# EAGLE board receiver_2v0 (EAGLE 6.2)
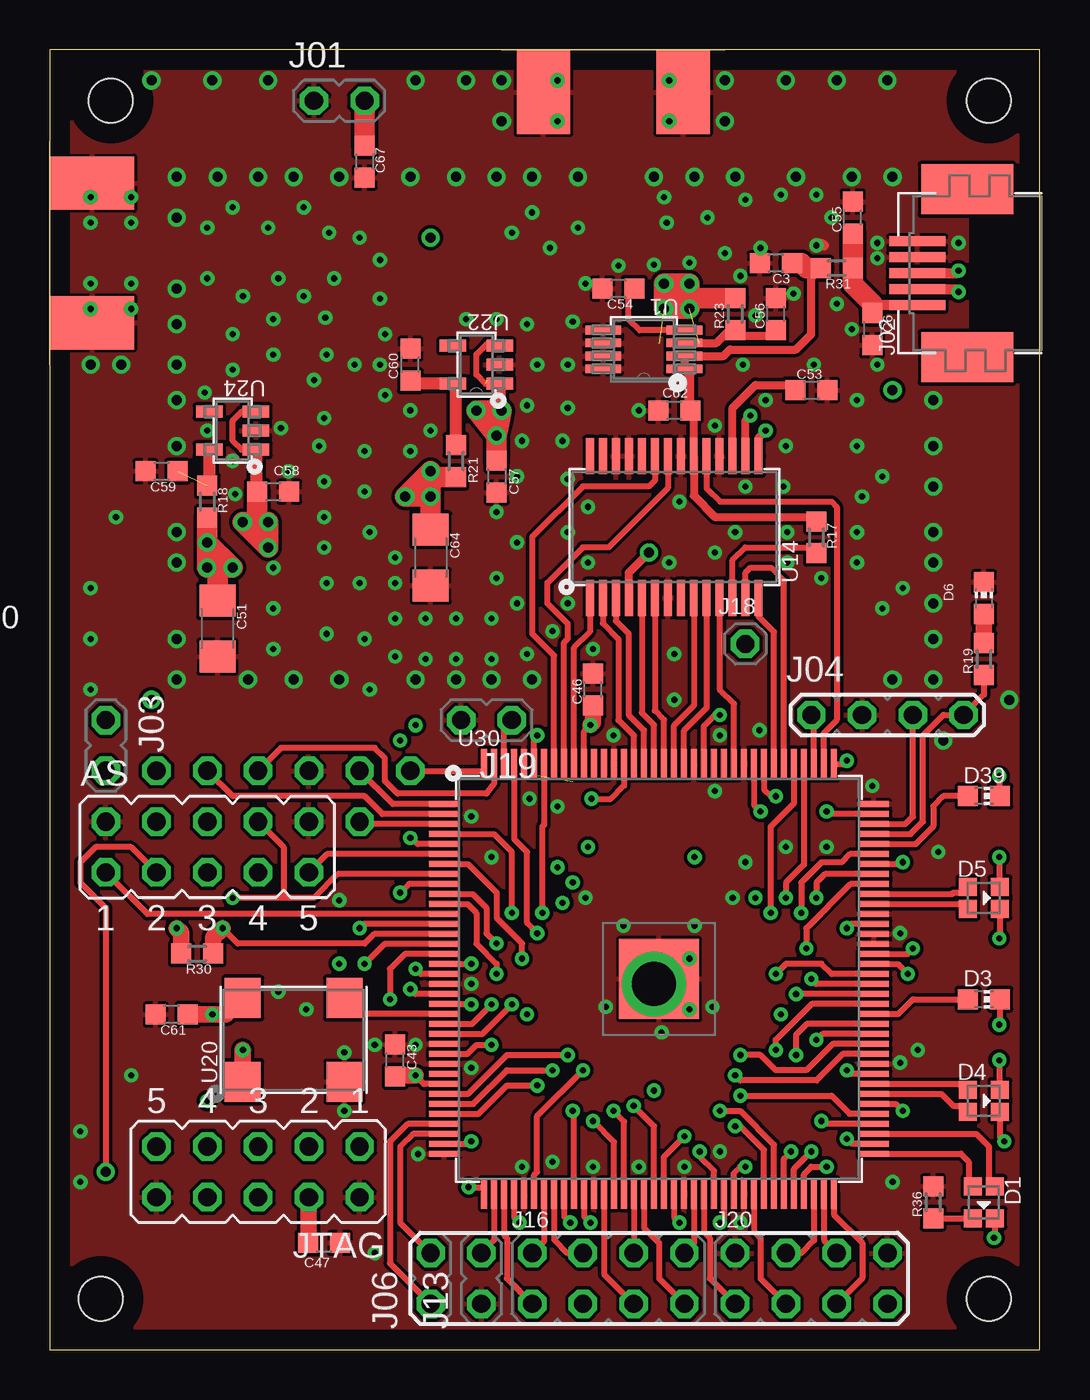
[diagram p3: board, top side]
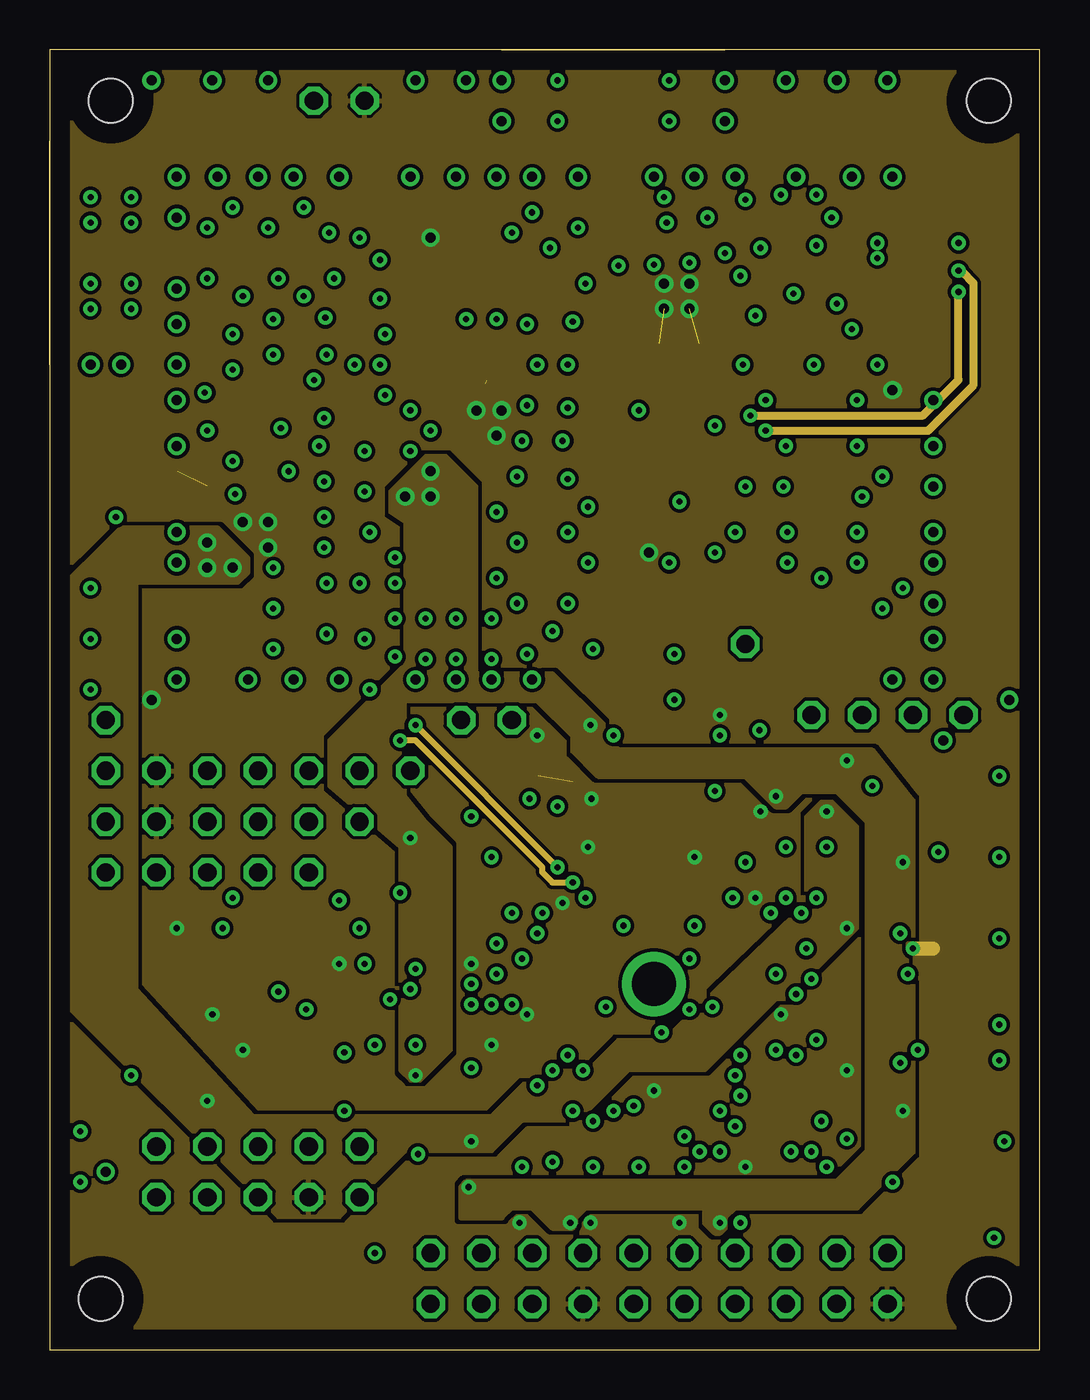
[diagram p4: board, inner layer Route8]
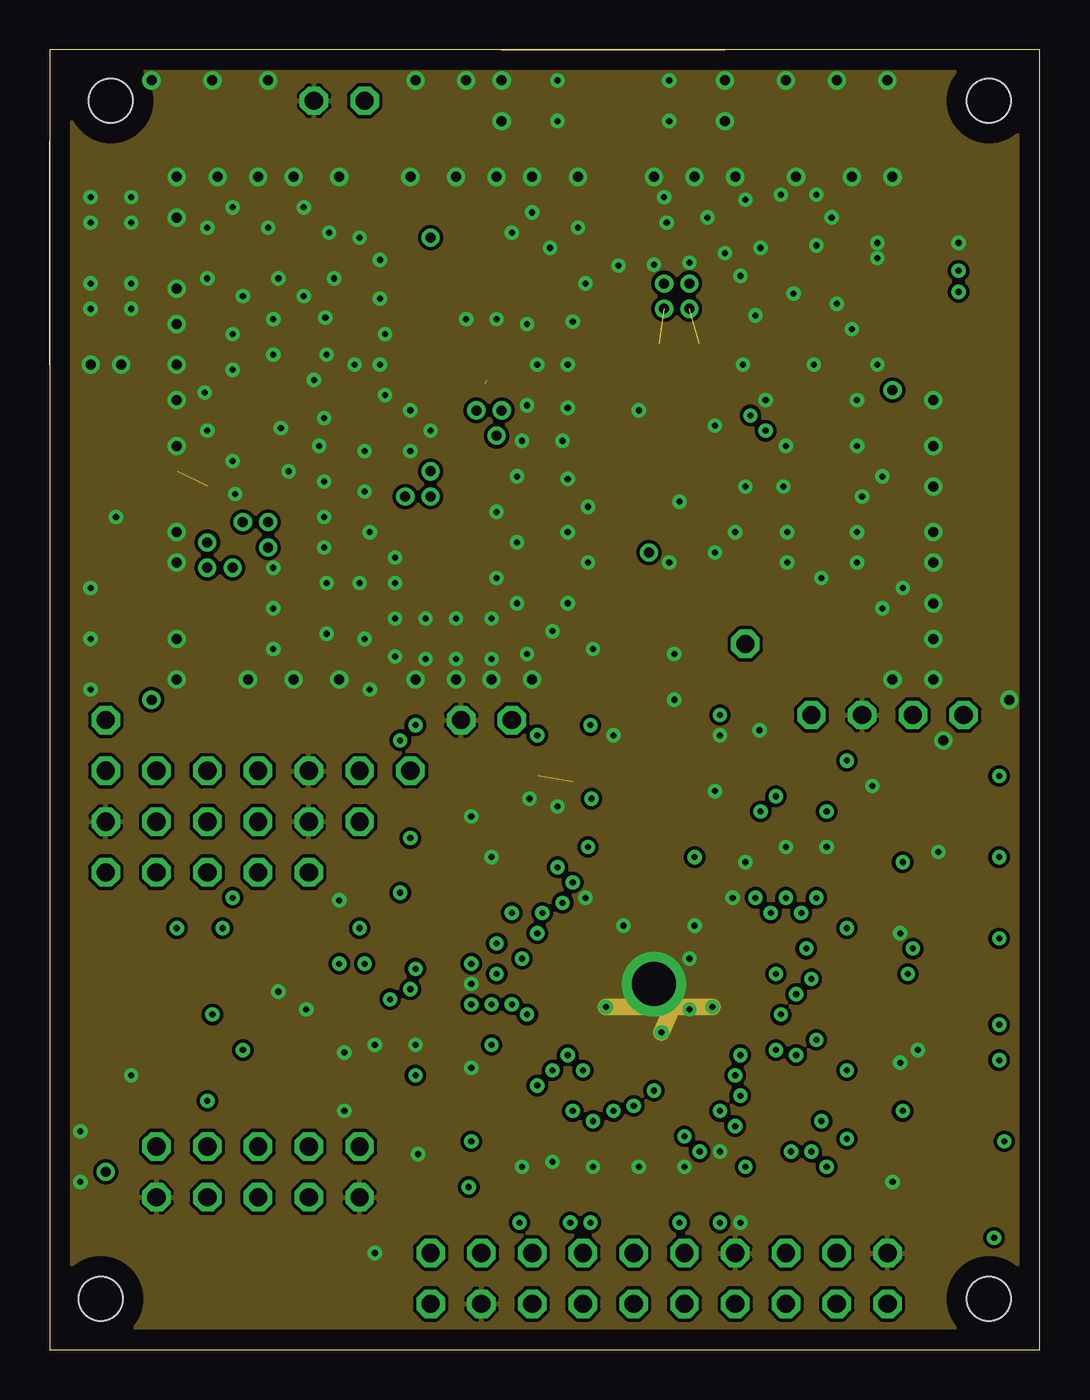
[diagram p5: board, inner layer GND]
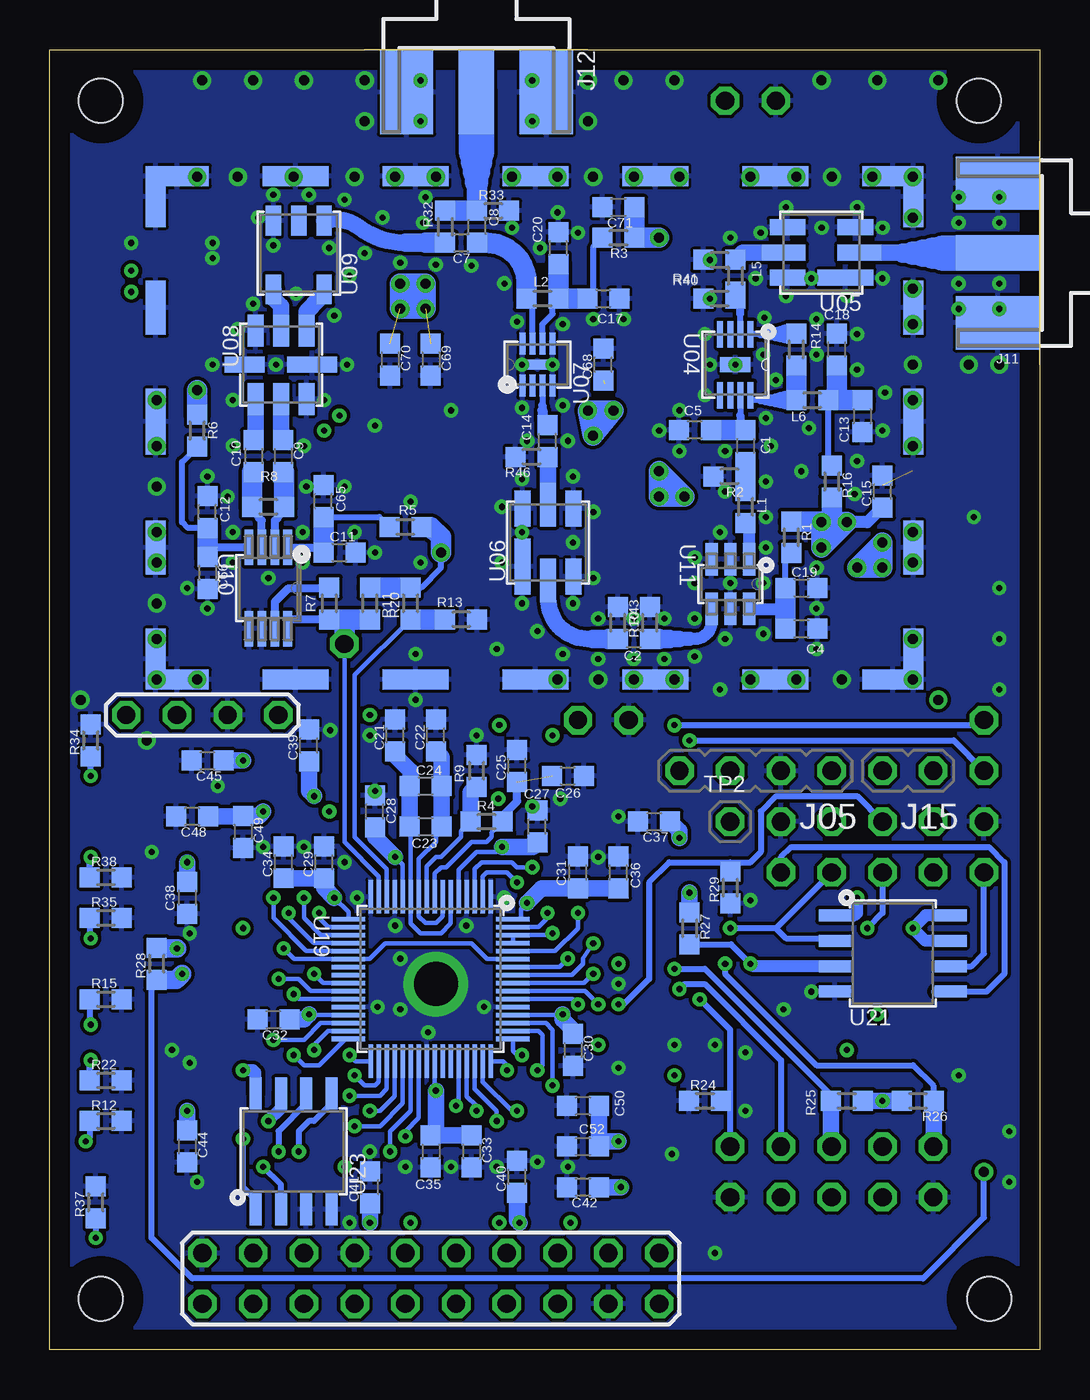
[diagram p6: board, bottom side, seen from below]

Size 49.54 x 65.02 mm. Coordinates in mm from the lower left corner, seen from the top.
Outline: 0,0 49.53,0 49.53,65.02 0,65.02 0,0
Copper layers (1*8+9*16): Top 0.035mm / dielectric 0.35mm / Route8 0.035mm / dielectric 0.35mm / GND 0.035mm / dielectric 0.35mm / Bottom 0.035mm
Design rules: minimum track width 6mil, minimum drill 24mil, track to track 7mil, track to pad 7mil, pad to pad 7mil, via to via 7mil, smd to smd 7mil, copper to edge 40mil, drill to drill 8mil, minimum pad ring 10mil, minimum via ring 8mil, stop-mask expansion 4mil, vias tented up to drill 20mil, thermal gap 6mil
Holes 2.2 mm at 3.05,62.48 46.99,62.48 46.99,2.54 2.54,2.54
bRestrict: area 14.7,49.8 to 15.7,50.3; area 14.7,48.3 to 15.7,48.8; area 37.6,49.8 to 38.9,50; area 37.6,48.5 to 38.9,48.8; area 24.6,53.8 to 25.1,54.4; area 35.3,17 to 35.6,17.3; area 25.4,17 to 25.7,17.3

## Footprints (pad centres in the part's own frame; a part is rotated, then mirrored left to right if it is on the bottom)
JP5Q = drill 0.914 octagon: 1 -5.08,-1.27; 2 -5.08,1.27; 3 -2.54,-1.27; 4 -2.54,1.27; 5 0,-1.27; 6 0,1.27; 7 2.54,-1.27; 8 2.54,1.27; 9 5.08,-1.27; 10 5.08,1.27
C0603 = smd 1 x 1: 1 -0.8,0; 2 0.8,0
C1206 = smd 1.6 x 1.8: 1 -1.4,0; 2 1.4,0
LED0606 = smd 0.9 x 0.9: A0 -0.8,0.55; A1 -0.8,-0.55; C0 0.8,0.55; C1 0.8,-0.55
LED0603 = smd 1 x 1: A -0.8,0; C 0.8,0
PH2 = drill 0.914 octagon: 1 0,-1.27; 2 0,1.27
UX60SC-MB-5ST = smd 0.5 x 2.8: 1 -1.6,0.8; 2 -0.8,0.8; 3 0,0.8; 4 0.8,0.8; 5 1.6,0.8 | smd 2.5 x 4.6: NC1 -4.2,-1.7; NC2 4.2,-1.7
PH4 = drill 0.914 octagon: 1 -3.81,0; 2 -1.27,0; 3 1.27,0; 4 3.81,0
J502-ND-142-0711-821/826 = smd 4.191 x 1.778: 1 2.115,0 | smd 4.191 x 2.667: G@1 2.115,3.495; G@2 2.115,-3.495 | smd 4.191 x 2.667 bottom: G@3 2.115,3.495; G@4 2.115,-3.495
PH8-2 = drill 0.914 octagon: 1 -3.81,-1.27; 2 -3.81,1.27; 3 -1.27,-1.27; 4 -1.27,1.27; 5 1.27,-1.27; 6 1.27,1.27; 7 3.81,-1.27; 8 3.81,1.27
PH1 = drill 0.914 octagon: 1 0,0
L0603 = smd 1 x 1: 1 -0.8,0; 2 0.8,0
R0603 = smd 1 x 1: 1 -0.8,0; 2 0.8,0
RM-08 = smd 1.778 x 0.432: 1 -2.032,0.965; 2 -2.032,0.33; 3 -2.032,-0.33; 4 -2.032,-0.965; 5 2.032,-0.965; 6 2.032,-0.33; 7 2.032,0.33; 8 2.032,0.965
CP-8-2 = smd 1.321 x 0.305: 1 -1.524,0.762; 2 -1.524,0.254; 3 -1.524,-0.254; 4 -1.524,-0.762; 5 1.524,-0.762; 6 1.524,-0.254; 7 1.524,0.254; 8 1.524,0.762 | smd 0.76 x 1.52: 9 0,0
SAW6 = smd 2.8 x 0.8: A -1.2,1.24 | smd 2.2 x 0.8: B -1.9,-0.03; E 1.9,-0.03 | smd 1.8 x 0.8: C -1.7,-1.3; D 1.7,-1.3; F 1.7,1.24
CP-8-1 = smd 0.3 x 1.1: 1 -0.75,-1.05; 2 -0.25,-1.05; 3 0.25,-1.05; 4 0.75,-1.05; 5 0.75,1.05; 6 0.25,1.05; 7 -0.25,1.05; 8 -0.75,1.05 | smd 1.8 x 0.5: 9 0,0
SAW8 = smd 0.8 x 1.6: P1 -1.27,-1.71; P2 0,-1.71; P3 1.27,-1.71; P5 1.27,1.71; P6 0,1.71; P7 -1.27,1.71 | smd 2 x 0.8: P4 1.81,0 | smd 2.5 x 0.8: P8 -1.55,0
AT224-1A = smd 0.76 x 1.5: 1 -1.27,1.61; 2 0,1.61; 3 1.27,1.61; 4 1.27,-1.82; 6 -1.27,-1.82
SOT23-6 = smd 1.626 x 0.61: 1 -1.195,0.95; 2 -1.195,0.01; 3 -1.195,-0.93; 4 1.295,-0.93; 5 1.295,0.01; 6 1.295,0.95
SSOP-28 = smd 1.8 x 0.4: 1 -3.55,4.23; 2 -3.55,3.58; 3 -3.55,2.93; 4 -3.55,2.28; 5 -3.55,1.63; 6 -3.55,0.98; 7 -3.55,0.33; 8 -3.55,-0.32; 9 -3.55,-0.97; 10 -3.55,-1.62; 11 -3.55,-2.27; 12 -3.55,-2.92; 13 -3.55,-3.57; 14 -3.55,-4.22; 15 3.55,-4.22; 16 3.55,-3.57; 17 3.55,-2.92; 18 3.55,-2.27; 19 3.55,-1.62; 20 3.55,-0.97; 21 3.55,-0.32; 22 3.55,0.33; 23 3.55,0.98; 24 3.55,1.63; 25 3.55,2.28; 26 3.55,2.93; 27 3.55,3.58; 28 3.55,4.23
ST-64-1 = smd 1.676 x 0.229: P1 -4.115,3; P2 -4.115,2.6; P3 -4.115,2.2; P4 -4.115,1.8; P5 -4.115,1.4; P6 -4.115,1; P7 -4.115,0.6; P8 -4.115,0.2; P9 -4.115,-0.2; P10 -4.115,-0.6; P11 -4.115,-1; P12 -4.115,-1.4; P13 -4.115,-1.8; P14 -4.115,-2.2; P15 -4.115,-2.6; P16 -4.115,-3; P33 4.115,-3; P34 4.115,-2.6; P35 4.115,-2.2; P36 4.115,-1.8; P37 4.115,-1.4; P38 4.115,-1; P39 4.115,-0.6; P40 4.115,-0.2; P41 4.115,0.2; P42 4.115,0.6; P43 4.115,1; P44 4.115,1.4; P45 4.115,1.8; P46 4.115,2.2; P47 4.115,2.6; P48 4.115,3 | smd 0.229 x 1.676: P17 -3,-4.115; P18 -2.6,-4.115; P19 -2.2,-4.115; P20 -1.8,-4.115; P21 -1.4,-4.115; P22 -1,-4.115; P23 -0.6,-4.115; P24 -0.2,-4.115; P25 0.2,-4.115; P26 0.6,-4.115; P27 1,-4.115; P28 1.4,-4.115; P29 1.8,-4.115; P30 2.2,-4.115; P31 2.6,-4.115; P32 3,-4.115; P49 3,4.115; P50 2.6,4.115; P51 2.2,4.115; P52 1.8,4.115; P53 1.4,4.115; P54 1,4.115; P55 0.6,4.115; P56 0.2,4.115; P57 -0.2,4.115; P58 -0.6,4.115; P59 -1,4.115; P60 -1.4,4.115; P61 -1.8,4.115; P62 -2.2,4.115; P63 -2.6,4.115; P64 -3,4.115
CB3 = smd 1.8 x 2: 1 -2.54,-2.1; 2 2.54,-2.1; 3 2.54,2.1; 4 -2.54,2.1
SOIC-8 = smd 1.6 x 0.6: 1 -2.9,1.91; 2 -2.9,0.64; 3 -2.9,-0.63; 4 -2.9,-1.9; 5 2.9,-1.9; 6 2.9,-0.63; 7 2.9,0.64; 8 2.9,1.91
UJ-5 = smd 1.321 x 0.6: 1 -1.168,0.95; 2 -1.168,0; 3 -1.168,-0.95; 4 1.168,-0.95; 5 1.168,0.95
EQFP144 = smd 1.5 x 0.3: 1 -10.75,8.75; 2 -10.75,8.25; 3 -10.75,7.75; 4 -10.75,7.25; 5 -10.75,6.75; 6 -10.75,6.25; 7 -10.75,5.75; 8 -10.75,5.25; 9 -10.75,4.75; 10 -10.75,4.25; 11 -10.75,3.75; 12 -10.75,3.25; 13 -10.75,2.75; 14 -10.75,2.25; 15 -10.75,1.75; 16 -10.75,1.25; 17 -10.75,0.75; 18 -10.75,0.25; 19 -10.75,-0.25; 20 -10.75,-0.75; 21 -10.75,-1.25; 22 -10.75,-1.75; 23 -10.75,-2.25; 24 -10.75,-2.75; 25 -10.75,-3.25; 26 -10.75,-3.75; 27 -10.75,-4.25; 28 -10.75,-4.75; 29 -10.75,-5.25; 30 -10.75,-5.75; 31 -10.75,-6.25; 32 -10.75,-6.75; 33 -10.75,-7.25; 34 -10.75,-7.75; 35 -10.75,-8.25; 36 -10.75,-8.75; 73 10.75,-8.75; 74 10.75,-8.25; 75 10.75,-7.75; 76 10.75,-7.25; 77 10.75,-6.75; 78 10.75,-6.25; 79 10.75,-5.75; 80 10.75,-5.25; 81 10.75,-4.75; 82 10.75,-4.25; 83 10.75,-3.75; 84 10.75,-3.25; 85 10.75,-2.75; 86 10.75,-2.25; 87 10.75,-1.75; 88 10.75,-1.25; 89 10.75,-0.75; 90 10.75,-0.25; 91 10.75,0.25; 92 10.75,0.75; 93 10.75,1.25; 94 10.75,1.75; 95 10.75,2.25; 96 10.75,2.75; 97 10.75,3.25; 98 10.75,3.75; 99 10.75,4.25; 100 10.75,4.75; 101 10.75,5.25; 102 10.75,5.75; 103 10.75,6.25; 104 10.75,6.75; 105 10.75,7.25; 106 10.75,7.75; 107 10.75,8.25; 108 10.75,8.75 | smd 0.3 x 1.5: 37 -8.75,-10.75; 38 -8.25,-10.75; 39 -7.75,-10.75; 40 -7.25,-10.75; 41 -6.75,-10.75; 42 -6.25,-10.75; 43 -5.75,-10.75; 44 -5.25,-10.75; 45 -4.75,-10.75; 46 -4.25,-10.75; 47 -3.75,-10.75; 48 -3.25,-10.75; 49 -2.75,-10.75; 50 -2.25,-10.75; 51 -1.75,-10.75; 52 -1.25,-10.75; 53 -0.75,-10.75; 54 -0.25,-10.75; 55 0.25,-10.75; 56 0.75,-10.75; 57 1.25,-10.75; 58 1.75,-10.75; 59 2.25,-10.75; 60 2.75,-10.75; 61 3.25,-10.75; 62 3.75,-10.75; 63 4.25,-10.75; 64 4.75,-10.75; 65 5.25,-10.75; 66 5.75,-10.75; 67 6.25,-10.75; 68 6.75,-10.75; 69 7.25,-10.75; 70 7.75,-10.75; 71 8.25,-10.75; 72 8.75,-10.75; 109 8.75,10.75; 110 8.25,10.75; 111 7.75,10.75; 112 7.25,10.75; 113 6.75,10.75; 114 6.25,10.75; 115 5.75,10.75; 116 5.25,10.75; 117 4.75,10.75; 118 4.25,10.75; 119 3.75,10.75; 120 3.25,10.75; 121 2.75,10.75; 122 2.25,10.75; 123 1.75,10.75; 124 1.25,10.75; 125 0.75,10.75; 126 0.25,10.75; 127 -0.25,10.75; 128 -0.75,10.75; 129 -1.25,10.75; 130 -1.75,10.75; 131 -2.25,10.75; 132 -2.75,10.75; 133 -3.25,10.75; 134 -3.75,10.75; 135 -4.25,10.75; 136 -4.75,10.75; 137 -5.25,10.75; 138 -5.75,10.75; 139 -6.25,10.75; 140 -6.75,10.75; 141 -7.25,10.75; 142 -7.75,10.75; 143 -8.25,10.75; 144 -8.75,10.75 | smd 4 x 4: 145 0,0
BMI-S-105 = smd 1 x 3.05: P$1 0.5,1.525; P$6 25.7,1.525 | smd 3.05 x 1: P$2 1.525,0.5; P$7 24.675,0.5; P$15 1.525,38.4; P$20 24.675,38.4 | smd 2.7 x 1: P$3 7.1,0.5; P$5 19.1,0.5; P$16 7.1,38.4; P$18 19.1,38.4 | smd 3.3 x 1: P$4 13.4,0.5; P$17 13.4,38.4 | smd 1 x 3.3: P$8 0.5,7.4; P$9 0.5,13.4; P$10 0.5,19.4; P$11 0.5,25.4; P$12 0.5,31.4; P$21 25.7,7.4; P$22 25.7,13.4; P$23 25.7,19.4; P$24 25.7,25.4; P$25 25.7,31.4 | smd 1 x 3.15: P$13 0.5,37.32; P$26 25.7,37.32

## Placement (x,y rotation side)
AS  [JP5Q]  7.87,25.15 0 top
C1  470pF  [C0603]  14.73,45.21 270 bottom
C2  2pF  [C0603]  20.32,35.56 180 bottom
C3  0.1uF  [C0603]  36.32,54.36 180 top
C4  1nF  [C0603]  11.94,36.07 0 bottom
C5  3(2.7)pF  [C0603]  17.27,46.01 180 bottom
C6  open  [C0603]  41.15,51.05 270 top
C7  (0)1nF  [C0603]  28.96,55.37 180 bottom
C8  0(1nF)  [C0603]  28.16,56.17 90 bottom
C9  0.1uF  [C0603]  37.87,44.7 270 bottom
C10  0.1uF  [C0603]  39.34,44.7 270 bottom
C11  100pF  [C0603]  35.05,39.88 0 bottom
C12  100pF  [C0603]  41.66,41.91 90 bottom
C13  1nF  [C0603]  8.89,46.7 270 bottom
C14  1nF  [C0603]  24.64,45.47 90 bottom
C15  open  [C0603]  7.87,42.93 90 bottom
C17  33pF  [C0603]  21.84,52.58 0 bottom
C18  open  [C0603]  10.16,50.04 90 bottom
C19  0.1uF  [C0603]  11.94,38.1 0 bottom
C20  4.7uF  [C0603]  24.09,55.12 90 bottom
C21  0.1uF  [C0603]  32.26,30.73 90 bottom
C22  0.1uF  [C0603]  30.23,30.73 90 bottom
C23  0.1uF  [C0603]  30.73,26.16 0 bottom
C24  4.7uF  [C0603]  30.73,28.19 0 bottom
C25  0.1uF  [C0603]  26.16,29.21 90 bottom
C26  4.7uF  [C0603]  23.62,28.7 0 bottom
C27  0.1uF  [C0603]  25.15,26.16 90 bottom
C28  0.1uF  [C0603]  33.27,26.92 90 bottom
C29  0.1uF  [C0603]  35.81,24.38 90 bottom
C30  0.1uF  [C0603]  23.37,14.99 270 bottom
C31  0.1uF  [C0603]  23.11,23.88 90 bottom
C32  0.1uF  [C0603]  38.35,16.51 180 bottom
C33  4.7uF  [C0603]  28.45,9.91 270 bottom
C34  4.7uF  [C0603]  37.85,24.38 90 bottom
C35  0.1uF  [C0603]  30.48,9.91 270 bottom
C36  4.7uF  [C0603]  21.08,23.88 90 bottom
C37  2.2nF  [C0603]  19.3,26.42 180 bottom
C38  4.7nF  [C0603]  42.67,22.61 270 bottom
C39  10nF  [C0603]  36.58,30.23 90 bottom
C40  10nF  [C0603]  26.16,8.64 90 bottom
C41  0.1uF  [C0603]  33.53,8.13 90 bottom
C42  0.1uF  [C0603]  22.86,8.13 180 bottom
C43  0.1uF  [C0603]  17.27,14.48 90 top
C44  0.1uF  [C0603]  42.67,10.16 270 bottom
C45  0.1uF  [C0603]  41.66,29.46 180 bottom
C46  0.1uF  [C0603]  27.18,33.02 90 top
C47  4.7uF  [C0603]  13.72,5.33 0 top
C48  0.1uF  [C0603]  42.42,26.67 180 bottom
C49  2.2nF  [C0603]  39.88,25.91 270 bottom
C50  22nF  [C0603]  22.86,12.19 180 bottom
C51  47uF  [C1206]  8.38,36.07 270 top
C52  2.2nF  [C0603]  22.86,10.16 180 bottom
C53  0.1uF  [C0603]  38.1,48.01 0 top
C54  10nF  [C0603]  28.45,53.09 180 top
C55  10nF  [C0603]  40.17,56.64 90 top
C56  2.2(4.7)uF  [C0603]  36.32,51.82 90 top
C57  1uF  [C0603]  22.35,43.69 270 top
C58  1uF  [C0603]  11.18,42.93 0 top
C59  1uF  [C0603]  5.59,43.94 180 top
C60  1uF  [C0603]  18.03,49.28 90 top
C61  10nF  [C0603]  6.1,16.76 180 top
C62  0.1uF  [C0603]  31.24,46.99 180 top
C64  47uF  [C1206]  19.05,39.62 270 top
C65  0.1uF  [C0603]  35.85,42.46 90 bottom
C66  0.1uF  [C0603]  41.66,38.86 270 bottom
C67  open  [C0603]  15.75,59.44 270 top
C68  open  [C0603]  21.84,49.28 90 bottom
C69  open  [C0603]  30.48,49.53 270 bottom
C70  open  [C0603]  32.51,49.53 270 bottom
C71  open  [C0603]  21.08,57.15 180 bottom
D1  [LED0606]  46.74,7.37 270 top
D3  yellow  [LED0603]  46.74,17.53 0 top
D4  [LED0606]  46.74,12.45 0 top
D5  [LED0606]  46.74,22.61 0 top
D6  blue  [LED0603]  46.74,37.59 90 top
D39  red  [LED0603]  46.74,27.69 0 top
J01  PH2  [PH2]  14.48,62.48 270 top
J02  UX60SC-MB-5ST  [UX60SC-MB-5ST]  44.2,53.85 90 top
J03  PH2  [PH2]  2.79,30.23 180 top
J04  PH4  [PH4]  41.91,31.75 0 top
J05  PH4  [PH4]  14.22,28.96 180 bottom
J06  PH2  [PH2]  19.05,3.56 0 top
J11  RFin  [J502-ND-142-0711-821/826]  0,54.86 180 bottom
J12  TESTio  [J502-ND-142-0711-821/826]  28.19,65.02 270 bottom
J13  PH2  [PH2]  21.59,3.56 0 top
J15  PH2  [PH2]  6.6,28.96 90 bottom
J16  PH8-2  [PH8-2]  27.94,3.56 0 top
J18  PH1  [PH1]  34.8,35.31 0 top
J19  PH2  [PH2]  21.84,31.5 90 top
J20  PH8-2  [PH8-2]  38.1,3.56 0 top
JTAG  [JP5Q]  10.41,8.89 180 top
L1  8.7nH  [L0603]  14.73,42.16 270 bottom
L2  100nH  [L0603]  24.89,52.58 180 bottom
L5  6nH  [L0603]  15.24,53.72 270 bottom
L6  5.1nH  [L0603]  11.39,47.5 180 bottom
R1  0  [R0603]  12.45,40.64 270 bottom
R2  open  [R0603]  15.53,43.69 180 bottom
R3  0  [R0603]  21.08,55.63 180 bottom
R4  3.9k  [R0603]  27.69,26.42 0 bottom
R5  10  [R0603]  31.75,41.15 180 bottom
R6  10  [R0603]  42.16,45.97 270 bottom
R7  3k  [R0603]  35.56,37.34 270 bottom
R8  53.6  [R0603]  38.61,42.16 0 bottom
R9  1.3k  [R0603]  28.19,28.96 270 bottom
R10  open  [R0603]  19.52,36.36 90 bottom
R11  open  [R0603]  33.53,37.34 90 bottom
R12  301  [R0603]  46.74,11.43 0 bottom
R13  0  [R0603]  28.96,36.54 180 bottom
R14  1.4k  [R0603]  12.19,50.04 90 bottom
R15  301  [R0603]  46.74,17.53 0 bottom
R16  0  [R0603]  10.41,43.43 270 bottom
R17  10k  [R0603]  38.35,40.64 270 top
R18  0  [R0603]  7.87,42.42 270 top
R19  301  [R0603]  46.74,34.54 90 top
R20  0  [R0603]  31.5,37.34 90 bottom
R21  0  [R0603]  20.32,44.45 270 top
R22  301  [R0603]  46.74,13.46 0 bottom
R23  0  [R0603]  34.29,51.82 90 top
R24  10k  [R0603]  16.76,12.45 0 bottom
R25  5.6k(TBD)  [R0603]  9.65,12.45 0 bottom
R26  5.6k(TBD)  [R0603]  6.1,12.45 180 bottom
R27  10k  [R0603]  17.53,21.08 270 bottom
R28  10k  [R0603]  44.2,19.3 90 bottom
R29  10k  [R0603]  15.49,23.11 90 bottom
R30  10k  [R0603]  7.37,19.81 180 top
R31  FAKE  [R0603]  39.37,54.1 180 top
R32  open  [R0603]  29.76,56.17 270 bottom
R33  (open)0  [R0603]  27.36,56.97 0 bottom
R34  499  [R0603]  47.5,30.48 90 bottom
R35  301  [R0603]  46.74,21.59 0 bottom
R36  301  [R0603]  44.2,7.37 90 top
R37  301  [R0603]  47.24,7.37 90 bottom
R38  301  [R0603]  46.74,23.62 0 bottom
R40  open  [R0603]  16.04,54.52 180 bottom
R41  open  [R0603]  16.04,52.58 180 bottom
R43  open  [R0603]  21.12,36.36 90 bottom
R46  open  [R0603]  25.44,44.67 180 bottom
TP2  PH1  [PH1]  15.49,26.42 0 bottom
U1  ADP1715ARMZ-3.3-R7  [RM-08]  29.72,50.04 180 top
U04  ADL5523ACPZ  [CP-8-2]  15.24,49.28 270 bottom
U05  SAW6  [SAW6]  10.92,54.86 180 bottom
U06  SAW6  [SAW6]  24.64,40.39 90 bottom
U07  AD8354ACPZ  [CP-8-1]  25.15,49.28 0 bottom
U08  SAW8  [SAW8]  37.97,49.28 180 bottom
U09  TC1-1-13M+  [AT224-1A]  37.08,54.86 0 bottom
U10  AD8313ARM  [RM-08]  38.61,38.1 270 bottom
U11  MAX2640EUT  [SOT23-6]  15.49,38.35 270 bottom
U14  FT245RL  [SSOP-28]  31.24,41.15 90 top
U19  AD9238BSTZ-20  [ST-64-1]  30.48,18.54 270 bottom
U20  CB3LV  [CB3]  12.19,15.49 0 top
U21  EPCS4SI8N  [SOIC-8]  7.37,19.81 0 bottom
U22  ADP151AUJZ-1.2-R7  [UJ-5]  21.34,49.28 180 top
U23  SST25VF512A-33-4C-SAE  [SOIC-8]  37.34,9.91 90 bottom
U24  ADP151AUJZ-2.5-R7  [UJ-5]  9.14,45.97 180 top
U30  EP3C5E144C8N  [EQFP144]  30.48,18.54 0 top
U$8  BMI-S-5  [BMI-S-105]  5.84,33.02 90 bottom

## Tracks (layer width: path | path; a pad name or v marks a point on that pad's centre or on a via)
+3V3  (via drill 0.3, 0.5)  (3 unrouted)
  Top 0.305: U24.1 9.59,45.02 9.14,45.47 9.14,46.48 9.59,46.92 U24.3 | U22.1 21.78,48.33 21.34,48.77 21.34,49.78 21.84,50.29 22.44,50.29 U22.3 | U30.130 28.73,28.22 28.07,27.56 v27.1,27.56 | U30.122 32.73,31.21 33.27,31.75 v33.53,31.75 | U30.117 35.23,27.25 v35.56,26.92 | U30.17 v21.07,19.29 v21.08,19.3 | U30.139 24.23,30.58 v24.38,30.73 | U30.26 20.89,14.79 21.34,15.24 v22.1,15.24 | U30.81 40.06,13.79 v39.88,13.97 | U30.56 31.23,6.62 v31.5,6.35 | U30.40 23.23,6.62 v23.5,6.35 | U30.62 34.23,8.83 34.54,9.14 v34.8,9.14 | U30.47 26.73,6.67 v27.05,6.35 | U30.93 42.91,19.79 v43.18,20.07
  Top 0.406: U14.4 28.96,38.87 v29.97,39.88
  Top 0.61: U24.1 10.31,42.99 C58.1 | U22.1 22.5,47.09 v22.61,46.99
  Top 0.813: U20.4 8.82,16.76 v8.13,16.76 C61.1 | U20.1 v9.65,14.99 | R30.2 6.57,20.87 v6.35,21.08
  Top 1.016: 10.41,41.4 v10.92,41.4 v10.92,40.13 v9.65,41.4 10.41,41.4 | C58.1 10.38,41.44 10.41,41.4 | v30.73,53.34 v30.73,52.07 v32,52.07 | v32,52.07 32,52.58 | 32,52.58 v32,53.34 v30.73,53.34 | v30.73,53.34 v32,52.07 | R23.2 32.04,52.62 32,52.58 | 22.45,46.21 v22.61,46.99 v21.34,46.99 v22.35,45.72 22.45,46.21 | C57.1 22.35,46.11 22.45,46.21 | C67.1 J01.2
  Route8 0.711: v43.18,20.07 44.2,20.07
  Bottom 0.229: U19.P5 29.08,24.01 28.19,24.89 27.18,24.89 v26.92,25.15 | U19.P12 31.88,24.26 v32.26,24.64 | 33.27,25.65 C28.1 | U19.P64 25.96,21.54 25.96,22.05 v25.65,22.35 | U19.P41 30.28,13.01 v30.23,12.95 | U19.P52 23.9,16.74 v23.88,16.76 | U19.P17 34.59,21.89 v35.31,22.61 | U19.P29 36.55,16.74 v36.58,16.76
  Bottom 0.305: R20.2 30.95,38.14 29.97,39.12 v29.97,39.88 | R27.2 15.46,20.28 v14.48,19.3
  Bottom 0.61: U21.3 14.36,19.18 v14.48,19.3 | U23.8 39.25,13.85 39.37,13.97 v39.88,13.97 | U21.8 5.71,21.72 v6.35,21.08 5.72,20.45 U21.7 | C15.1 7.91,42.13 8.64,41.4 v9.65,41.4
  Bottom 0.813: 33.27,25.65 v32.26,24.64 | v30.23,12.95 30.23,10.96 C35.1 C33.1 | v25.65,22.35 24.93,23.08 C31.1 C36.1 | v35.31,22.61 35.81,23.11 C29.1 C34.1 | C32.1 36.83,16.51 v36.58,16.76 | v26.92,25.15 25.36,25.15 C27.1 | C30.1 23.37,16 23.88,16.51 v23.88,16.76
  Bottom 0.914: v43.18,20.07 44.16,20.07 R28.2
  Bottom 1.016: R11.2 R20.2 | v10.92,41.4 v10.92,40.13 v9.65,41.4 10.41,41.4 | v10.92,41.4 10.41,41.4 | R1.1 10.96,41.44 v10.92,41.4 | R16.2 10.41,41.4 | v32,52.07 v32,53.34 v30.73,53.34 | v30.73,53.34 v30.73,52.07 v32,52.07 | v32,52.07 v30.73,53.34 | R5.1 30.48,41.15 29.97,40.64 v29.97,39.88 | v19.05,55.63 R3.1 C71.1 | R6.1 v42.16,48.01 | v21.34,46.99 v22.61,46.99 v22.35,45.72 v21.34,46.99
  other vias: 5.08,32.51
  pour Route8 (rank 3): 0,65.02 49.53,65.02 49.53,0 0,0
+5V
  Top 0.305: 38.32,41.66 R17.1
  Top 0.406: R17.1 38.14,41.66 33.27,41.66 32.21,42.72 U14.20 32.21,46.82 C62.1 32,46.99 | U1.1 U1.2 33.71,49.71 34.04,50.04 37.34,50.04 38.1,50.8 38.1,53.63 R31.2
  Top 0.508: 32,46.99 32,48.82 U1.1
  Top 1.016: C3.1 37.59,54.36 37.85,54.1 R31.2
AD18  (via drill 0.3)
  Top 0.305: v36.07,21.84 36.07,26.16 37.23,27.32 U30.113
  Bottom 0.229: U19.P18 35.62,21.14 36.07,21.59 v36.07,21.84
AD19  (via drill 0.3)
  Top 0.305: U30.112 37.73,24.27 36.83,23.37 v36.83,22.61
  Bottom 0.229: U19.P19 35.98,20.74 36.83,21.59 v36.83,22.61
AD20  (via drill 0.3)
  Top 0.305: v37.59,21.84 37.59,23.37 38.61,24.38 39.62,24.38 40.03,24.79 U30.103
  Bottom 0.229: U19.P20 36.34,20.34 37.59,21.59 v37.59,21.84
AD21  (via drill 0.3)
  Top 0.305: U30.101 38.78,23.79 38.35,23.37 v38.35,22.61
  Bottom 0.229: U19.P21 36.71,19.94 38.35,21.59 v38.35,22.61
AD22  (via drill 0.3)
  Top 0.305: U30.100 40.06,23.29 37.85,21.08 v37.85,20.07
  Bottom 0.229: v37.85,20.07 37.32,19.54 U19.P22 33.54,19.54 32.77,20.32 28.45,20.32 27.67,19.54 U19.P59
AD25  (via drill 0.3)
  Top 0.305: U30.91 39.12,18.79 38.61,19.3 36.83,19.3 v36.32,18.8
  Bottom 0.229: U19.P25 35.87,18.34 v36.32,18.8
AD26  (via drill 0.3)
  Top 0.305: U30.90 38.35,18.29 v38.1,18.54
  Bottom 0.229: U19.P26 36.48,17.94 37.08,18.54 v38.1,18.54
AD27  (via drill 0.3)
  Top 0.305: U30.89 37.35,17.79 v37.34,17.78
  Bottom 0.229: U19.P27 37.1,17.54 v37.34,17.78
AD30  (via drill 0.3)
  Top 0.305: U30.85 38.65,15.79 v38.35,15.49
  Bottom 0.229: U19.P30 35.98,16.34 36.83,15.49 v38.35,15.49
AD31  (via drill 0.3)
  Top 0.305: U30.88 38.12,17.29 36.32,15.49 v36.32,14.99
  Bottom 0.229: U19.P31 35.62,15.94 36.32,15.24 v36.32,14.99
AD32  (via drill 0.3)
  Top 0.305: U30.86 37.88,16.29 37.34,15.75 v37.34,14.73
  Bottom 0.229: U19.P32 34.75,15.54 36.07,14.22 36.83,14.22 v37.34,14.73
AD33  (via drill 0.3)
  Top 0.305: U30.84 39.17,15.29 37.85,13.97 36.32,13.97 35.56,14.73 v34.54,14.73
  Bottom 0.229: U19.P33 34.24,14.43 v34.54,14.73
AD34  (via drill 0.3)
  Top 0.305: U30.83 39.68,14.79 38.35,13.46 34.54,13.46 v34.29,13.72
  Bottom 0.229: U19.P34 33.08,13.4 33.27,13.21 33.78,13.21 v34.29,13.72
AD35  (via drill 0.3)
  Top 0.305: U30.77 40.02,11.79 39.12,12.7 v34.54,12.7
  Bottom 0.229: U19.P35 32.68,13.04 33.02,12.7 v34.54,12.7
AD36  (via drill 0.3)
  Top 0.305: v33.53,11.94 34.54,11.94 36.23,10.25 U30.66
  Bottom 0.229: U19.P36 32.28,12.68 33.02,11.94 v33.53,11.94
AD37  (via drill 0.3)
  Top 0.305: U30.65 35.73,9.99 34.54,11.18 v34.29,11.18
  Bottom 0.229: U19.P37 31.88,12.32 33.02,11.18 v34.29,11.18
AD38  (via drill 0.3)
  Top 0.305: v32.51,9.91 32.51,9.65 33.23,8.93 U30.60
  Bottom 0.229: U19.P38 31.48,11.95 32.51,10.92 v32.51,9.91
AD39  (via drill 0.3)
  Top 0.305: U30.55 30.73,9.65 v31.75,10.67
  Bottom 0.229: U19.P39 31.08,11.59 31.75,10.92 v31.75,10.67
AD44  (via drill 0.3)
  Top 0.305: U30.54 30.23,11.17 v29.21,12.19
  Bottom 0.229: U19.P44 29.08,12.32 v29.21,12.19
AD45  (via drill 0.3)
  Top 0.305: U30.51 28.73,11.4 v28.19,11.94
  Bottom 0.229: U19.P45 28.68,12.68 28.19,12.19 v28.19,11.94
AD46  (via drill 0.3)
  Top 0.305: U30.50 28.23,10.38 v27.18,11.43
  Bottom 0.229: U19.P46 28.28,13.04 27.18,11.94 v27.18,11.43
AD47  (via drill 0.3)
  Top 0.305: U30.46 26.23,11.87 v26.16,11.94
  Bottom 0.229: U19.P47 27.88,13.4 26.42,11.94 v26.16,11.94
AD48  (via drill 0.3)
  Top 0.305: U30.42 24.23,8.74 24.38,8.89 24.38,11.68 v26.67,13.97
  Bottom 0.229: U19.P48 26.87,14.43 26.67,14.22 v26.67,13.97
AD49  (via drill 0.3)
  Top 0.305: U30.30 20.92,12.79 22.86,14.73 v25.91,14.73
  Bottom 0.229: U19.P49 26.36,14.94 26.16,14.73 v25.91,14.73
AD50  (via drill 0.3)
  Top 0.305: U30.31 21.18,12.29 22.86,13.97 v25.15,13.97
  Bottom 0.229: U19.P50 25.09,15.94 24.89,15.75 24.89,14.22 v25.15,13.97
AD51  (via drill 0.3)
  Top 0.305: U30.32 21.44,11.79 22.86,13.21 v24.38,13.21
  Bottom 0.229: U19.P51 24.72,16.34 24.38,16 v24.38,13.21
AD54  (via drill 0.3)
  Top 0.305: U30.24 21.63,15.79 v23.11,17.27
  Bottom 0.229: U19.P54 23.38,17.54 v23.11,17.27
AD55  (via drill 0.3)
  Top 0.305: U30.23 21.12,16.29 v22.1,17.27
  Bottom 0.229: U19.P55 22.77,17.94 v22.1,17.27
AD56  (via drill 0.3)
  Top 0.305: v22.35,18.8 22.35,19.3 21.34,20.32 21.34,21.84 20.89,22.29 U30.11
  Bottom 0.229: U19.P56 22.81,18.34 v22.35,18.8
AD57  (via drill 0.3)
  Top 0.305: U30.10 21.15,22.79 21.84,22.1 21.84,20.83 v22.35,20.32
  Bottom 0.229: U19.P57 23.42,18.74 22.86,19.3 22.86,19.56 v22.35,20.32
AD58  (via drill 0.3)
  Top 0.305: v23.62,19.56 23.62,20.32 22.35,21.59 22.35,22.86 20.92,24.29 U30.7
  Bottom 0.229: U19.P58 24.04,19.14 v23.62,19.56
AD60  (via drill 0.3)
  Top 0.305: v23.11,21.84 23.11,24.89 22.21,25.79 U30.4
  Bottom 0.229: U19.P60 24.25,19.94 23.11,21.08 v23.11,21.84
AD62  (via drill 0.3)
  Top 0.305: v24.38,20.83 23.88,21.34 23.88,24.89 23.23,25.54 U30.141
  Bottom 0.229: U19.P61 U19.P62 24.47,20.74 v24.38,20.83
AD63  (via drill 0.3)
  Top 0.305: v24.64,21.84 24.64,26.16 24.73,26.25 U30.138
  Bottom 0.229: U19.P63 25.09,21.14 24.64,21.59 v24.64,21.84
ADP1715_3
  Top 0.406: U1.3 33.35,50.37 34,51.02 R23.1 34.04,50.8 34.21,50.8 34.29,50.72 36.07,50.72 36.07,50.76 C56.1
ADREFB
  Bottom 0.229: U19.P7 29.88,21.68 30.23,21.34 30.73,21.34 31.08,21.68 U19.P10 31.08,24.55 30.23,25.4 30.23,25.87 C23.2
  Bottom 0.813: C23.2 C24.2 29.93,29.64 C22.1
ADREFY
  Bottom 0.229: U19.P6 29.48,21.32 29.97,20.83 30.99,20.83 31.48,21.32 U19.P11 31.48,26.11 C23.1
  Bottom 0.813: C23.1 C24.1 31.5,28.23 31.5,28.96 32.26,29.72 C21.1
ADSENSE
  Bottom 0.229: U19.P9 30.68,24.18 30.23,24.64 29.97,24.64 28.96,25.65 28.96,25.95 R4.1
  Bottom 0.813: R4.1 28.49,27.86 R9.2
ADVINMA  (via drill 0.3)
  Route8 0.305: v25.4,24.13 v18.29,31.24
  Bottom 0.229: U19.P3 28.28,24.04 27.94,24.38 26.42,24.38 26.16,24.13 v25.4,24.13
  Bottom 0.305: v18.29,31.24 3.05,31.24 J03.1
ADVINMB
  Bottom 0.229: R20.1 31.53,36.54 | U19.P14 32.68,24.04 34.29,25.65 34.29,33.74 R20.1 | R20.1 31.5,36.32
  Bottom 0.305: 31.53,36.54 31.53,36.28
  Bottom 1.016: R13.2 R20.1 | R20.1
ADVINPA  (via drill 0.3)
  Route8 0.305: v26.16,23.37 25.15,23.37 24.64,23.88 24.64,24.13 18.29,30.48 v17.53,30.48
  Bottom 0.229: U19.P2 27.88,23.68 27.69,23.88 26.67,23.88 v26.16,23.37
  Bottom 0.305: v17.53,30.48 4.32,30.48 J03.2
ADVREF  (1 unrouted)
  Bottom 0.229: R4.2 27.43,25.87 27.43,25.65 27.69,25.4 28.45,25.4 29.72,24.13 29.97,24.13 30.28,23.82 U19.P8
  Bottom 0.406: R4.2 26.89,26.71 26.16,27.43 C25.1
EPCS1  (via drill 0.3)
  Top 0.305: U30.8 14.39,23.79 13.21,22.61 11.68,22.61 | AS.8 11.68,25.15 11.68,22.61 | 11.68,22.61 v9.14,22.61
  Bottom 0.305: U21.1 9.77,21.72
  Bottom 0.61: 9.77,21.72 9.27,21.72 9.14,21.84 v9.14,22.61
EPCS2  (via drill 0.3)
  Top 0.305: U30.13 15.7,21.29 v15.49,21.08
  Bottom 0.305: AS.7 13.21,21.08 | 13.21,21.08 v15.49,21.08 | 13.21,21.08 12.7,20.57 10.39,20.57 U21.2
EPCS5
  Top 0.305: U30.6 13.87,24.79 AS.9
  Bottom 0.305: AS.9 12.95,24.64 12.45,25.15 2.54,25.15 1.78,24.38 1.78,18.8 2.66,17.91 U21.5
  Bottom 0.508: U21.5 5.2,17.91
EPCS6
  Top 0.305: U30.12 4.88,21.79 AS.1
  Bottom 0.305: U21.6 3.42,19.18 2.79,19.81 AS.1
FPGA1
  Top 0.305: U30.1 17.16,27.29 J05.3
FPGA2
  Top 0.305: U30.2 16.64,26.79 15.75,27.69 9.14,27.69 J15.2
FPGA3
  Top 0.305: U30.3 15.62,26.29 TP2.1
FPGA9  (via drill 0.3)
  Top 0.305: U30.9 17.96,23.29 v17.53,22.86
  Bottom 0.813: R27.1 v17.53,22.86
FPGA14  (via drill 0.3)
  Top 0.305: U30.14 16.22,20.79 15.75,20.32 9.4,20.32 v8.64,21.08
  Top 0.813: R30.1 8.17,20.61 v8.64,21.08
  Bottom 0.305: AS.5 7.87,21.84 v8.64,21.08
FPGA15  (via drill 0.3)
  Top 0.305: U30.15 16.74,20.29 v15.75,19.3
  Bottom 0.305: R26.1 5.33,12.48 5.33,13.21 6.35,14.22 11.18,14.22 15.75,18.8 v15.75,19.3
  Bottom 0.813: R26.1 5.3,10.2 JTAG.9
FPGA16  (via drill 0.3)
  Top 0.305: U30.16 17.76,19.79 17.02,19.05 v17.02,17.53
  Bottom 0.305: JTAG.1 15.49,12.19 | R24.2 15.75,12.45 15.49,12.19 | 15.49,12.19 15.49,16 v17.02,17.53
FPGA18  (via drill 0.3)
  Top 0.305: U30.18 18.55,18.79 v18.29,19.05
  Bottom 0.305: v18.29,19.05 16.76,19.05 10.45,12.74 R25.1
  Bottom 0.813: R25.1 10.45,10.2 JTAG.5
FPGA20  (via drill 0.3)
  Top 0.305: U30.20 18.28,17.79 v18.03,18.03
  Bottom 0.305: v18.03,18.03 17.78,18.29 16.76,18.29 12.95,14.48 JTAG.3
FPGA21  (via drill 0.3)
  Top 0.305: U30.21 21.06,17.29 v21.08,17.27
  Bottom 0.305: v21.08,17.27 20.83,17.27 19.56,18.54 19.56,23.37 18.54,24.38 15.49,24.38 | AS.6 9.14,27.69 13.21,27.69 13.97,26.92 13.97,24.89 14.48,24.38 15.49,24.38 | R29.2 15.49,24.38
FPGA33
  Top 0.305: U30.33 17.9,11.29 17.02,10.41 17.02,4.32 J06.1
FPGA34
  Top 0.305: U30.34 18.16,10.79 17.53,10.16 17.53,6.35 J06.2
FPGA38
  Top 0.305: U30.38 22.23,5.47 J13.2
FPGA39
  Top 0.305: U30.39 22.73,5.72 22.86,5.59 22.86,3.56 J16.1
FPGA43
  Top 0.305: U30.43 24.73,5.43 J16.2
FPGA44
  Top 0.305: U30.44 25.23,5.5 25.91,4.83 J16.4
FPGA49
  Top 0.305: U30.49 27.73,3.77 J16.5
FPGA52
  Top 0.305: U30.52 29.23,4.85 J16.6
FPGA53
  Top 0.305: U30.53 29.73,6.08 30.48,5.33 30.48,3.56 J16.7
FPGA58
  Top 0.305: U30.58 32.23,5.31 J16.8
FPGA59
  Top 0.305: U30.59 32.73,5.88 33.02,5.59 33.02,3.56 J20.1
FPGA64
  Top 0.305: U30.64 35.23,5.92 35.56,5.59 35.56,3.56 J20.3
FPGA70
  Top 0.305: U30.70 38.23,5.46 37.59,4.83 J20.4
FPGA71
  Top 0.305: U30.71 38.73,5.47 J20.6
FPGA72
  Top 0.305: U30.72 39.23,6.74 40.64,5.33 40.64,3.56 J20.5
FPGA92  (via drill 0.3, 0.5)
  Top 0.305: AS.3 4.06,25.15 2.29,25.15 1.52,24.38 1.52,23.37 2.79,22.1 v2.79,8.89 | U30.92 42.43,19.29 v42.93,18.8
  Bottom 0.305: v2.79,8.89 2.79,6.6 5.84,3.56 42.42,3.56 44.45,5.59 44.45,18.25 R28.1
  Bottom 0.914: R28.1 43.22,18.5 v42.93,18.8
FPGA142
  Top 0.305: U30.142 22.73,31.11 J19.1
FPGA143
  Top 0.305: U30.143 22.23,28.33 21.84,27.81 17.4,27.81 16.76,28.45 16.76,29.59 16.26,30.1 11.56,30.1 J05.1
FPGA144
  Top 0.305: J05.4 21.73,28.96 U30.144
FT1
  Top 0.305: U14.1 27.01,35.9 26.23,35.12 U30.135
FT2
  Top 0.305: U14.2 27.66,36.35 28.45,35.56 28.45,31.5 29.23,30.71 U30.129
FT3
  Top 0.305: U14.3 28.31,36.46 28.96,35.81 28.96,31.75 29.73,30.98 U30.128
FT5
  Top 0.305: U30.127 30.23,31.24 29.61,31.86 U14.5
FT6
  Top 0.305: U30.126 30.73,31.5 30.26,31.97 U14.6
FT9
  Top 0.305: U30.125 31.23,31.23 32.21,32.21 U14.9
FT10
  Top 0.305: U30.124 31.73,30.97 32.86,32.1 U14.10
FT11
  Top 0.305: U14.11 33.51,33.04 34.23,32.32 U30.119
FT12
  Top 0.305: U14.12 34.16,39.5 34.8,40.13 38.32,40.13 R17.2
FT13
  Top 0.305: U14.13 34.81,38.88 35.05,39.12 36.07,39.12 36.73,38.45 U30.114
FT14
  Top 0.305: U14.14 35.46,36.67 36.23,35.91 U30.115
FT19
  Top 0.305: U14.19 32.86,43.08 33.53,42.42 39.12,42.42 39.37,42.16 39.37,31.5 38.73,30.86 U30.110
FT22
  Top 0.305: U14.22 30.91,43.1 27.94,40.13 26.67,40.13 24.89,38.35 24.89,37.34 25.91,36.32 25.91,35.56 25.73,35.38 U30.136
FT23
  Top 0.305: U14.23 30.26,43.47 29.97,43.18 26.67,43.18 24.13,40.64 24.13,35.81 25.23,34.71 U30.137
GI01
  Top 0.305: U30.111 38.23,31.62 J04.1
GI03
  Top 0.305: U30.106 42.8,26.29 43.18,26.67 J04.3
GI04
  Top 0.305: U30.105 43.06,25.79 43.69,26.42 43.69,30.73 44.7,31.75 J04.4 46.74,32.77 R19.1
GND  (via drill 0.3, 0.5, 2.2)
  Top 0.406: 38.73,55.24 38.61,55.37
  Top 0.508: 38.48,55.24 38.73,55.24
  GND 0.813: 30.99,16.76 v30.61,15.88 | v27.81,17.14 v33.15,17.14
  other vias: 6.35,56.64 6.35,53.09 6.35,51.31 32.26,58.67 30.23,58.67 26.42,58.67 24.13,58.67 20.32,58.67 18.03,58.67 14.73,11.94 21.08,18.29 16,33.02 2.03,57.66 2.03,49.28 3.56,49.28 22.61,61.47 22.61,63.5 33.78,63.5 33.78,61.47 48.01,32.51 44.2,35.56 42.55,14.35 42.55,20.83 44.45,24.89 44.7,30.48 22.35,58.67 16.26,4.83 34.54,6.35 42.16,8.38 4.06,13.72 1.52,8.38 1.52,10.92 2.03,33.02 2.03,35.56 2.03,38.1 5.08,63.5 8.13,63.5 10.92,63.5 18.29,63.5 20.83,63.5 41.91,63.5 39.37,63.5 36.83,63.5 33.53,9.91 43.43,14.99 36.83,25.15 34.16,22.61 18.41,9.78 21.08,26.67 25.4,61.47 25.4,63.5 30.99,63.5 30.99,61.47 4.06,57.66 4.06,52.07 2.03,52.07 30.23,18.29 2.03,53.34 4.06,53.34 2.03,56.39 4.06,56.39 7.87,53.59 7.87,56.13 9.65,52.7 9.14,57.15 11.43,53.59 12.7,52.7 12.7,57.15 13.97,55.88 14.22,53.59 15.49,55.63 16.51,54.52 13.78,51.63 16.51,52.58 16.76,50.8 16.51,49.28 15.24,49.28 13.21,48.51 13.84,49.78 13.72,46.61 11.56,46.1 16.76,47.75 18.03,46.99 18.03,44.96 19.05,45.97 15.75,44.96 13.46,45.21 15.75,42.93 16,40.89 13.72,43.43 13.72,41.66 13.84,38.35 13.72,40.13 15.49,38.35 17.27,38.35 15.75,35.56 17.27,39.62 17.27,36.58 11.18,49.78 17.27,34.67 20.32,34.54 18.8,34.54 22.1,34.54 23.88,34.8 25.15,35.94 25.91,37.34 22.35,38.61 26.92,39.37 13.84,35.81 24.38,49.28 25.91,49.28 23.37,40.39 22.35,41.91 25.91,40.89 26.92,42.16 25.91,43.56 25.65,45.47 23.37,43.69 23.37,37.34 22.1,36.58 20.32,36.58 18.8,36.58 23.62,45.47 23.88,47.24 25.91,47.12 23.88,51.31 26.16,51.44 26.8,53.34 28.45,54.23 30.23,54.28 32,54.38 33.78,54.86 35.56,55.12 30.86,56.39 32.89,56.64 36.58,57.78 38.35,57.78 34.8,57.53 30.73,57.66 39.12,56.64 38.35,55.24 37.21,52.83 41.4,49.28 38.23,49.28 34.67,49.28 35.81,47.5 40.13,51.05 39.37,52.32 36.7,43.18 36.89,40.89 36.89,39.37 40.39,39.37 40.39,40.89 40.64,42.67 36.83,45.21 25.02,55.12 26.42,56.13 35.31,51.74 34.54,53.72 38.61,38.61 22.35,51.56 20.83,51.56 24.13,56.9 10.92,56.13 11.18,51.56 9.14,50.8 9.14,49.02 11.18,39.12 11.94,43.94 11.18,37.08 11.18,35.05 7.75,47.88 7.87,45.97 9.14,44.45 9.27,42.8 3.3,41.66 40.39,45.21 40.39,47.5 30.99,39.37 34.29,40.89 41.66,37.08 41.66,43.69 42.67,38.1 33.27,46.23 23.11,55.88 34.8,43.18 31.5,42.42 29.46,46.99 33.27,39.88 41.4,54.61 41.4,55.37 45.47,55.37 28.7,21.21 32.26,21.21 26.8,22.61 27.18,9.14 31.75,9.14 23.62,9.14 27.18,35.05 35.51,30.99 31.24,32.51 25.4,27.18 28.19,30.73 34.8,24.38 33.53,30.73 41.15,28.19 33.27,27.94 14.73,14.86 18.29,15.24 16.26,15.24 12.83,17.02 11.43,17.91 38.86,25.15 24,27.56 22.1,24.64 21.08,14.1 29.46,9.14 14.48,22.48 25.15,9.4 32,17.02 32,19.56 31.24,34.8 14.48,58.67 12.19,58.67 10.41,58.67 8.38,58.67 6.35,58.67 37.34,58.67 40.13,58.67 34.29,58.67 42.16,58.67 6.35,47.5 6.35,49.28 6.35,45.21 6.35,40.89 6.35,39.37 6.35,33.53 6.35,35.56 9.91,33.53 12.19,33.53 14.48,33.53 18.29,33.53 20.32,33.53 22.1,33.53 24.13,33.53 44.2,47.5 44.2,45.21 44.2,43.18 44.2,40.89 44.2,39.37 44.2,37.34 44.2,33.53 42.16,33.53
  pour Top: 49.53,65.02 0,65.02 0,0 49.53,0
  pour Bottom: 0,65.02 49.53,65.02 49.53,0 0,0
  pour GND: 0,65.02 49.53,65.02 49.53,0 0,0
IF
  Bottom 0.229: U19.P15 33.08,23.68 34.8,25.4 J18.1
  Bottom 0.406: R7.2 37.55,36.54 | 37.55,36.54 37.59,36.58 | U10.8 37.64,36.45 37.55,36.54
  Bottom 1.016: R7.2 35.05,36.54 | 35.05,36.54 R11.1 | J18.1 34.8,36.28 35.05,36.54
LED1A
  Top 0.305: U30.73 45.58,9.79 45.97,9.4 45.97,8.38 D1.A1
LED1B
  Top 0.305: U30.75 46.36,10.79 46.99,10.16 46.99,8.46 D1.A0
LED2A
  Top 0.305: U30.79 44.61,12.79 45.21,12.19 45.64,12.19 D4.A1
LED2B
  Top 0.305: U30.80 45.64,13.29 D4.A0
LED3
  Top 0.305: U30.87 42.45,16.79 43.18,17.53 D3.A
LED4A
  Top 0.305: U30.98 45.7,22.29 D5.A1
LED4B
  Top 0.305: U30.99 45.14,22.79 45.21,22.86 45.64,22.86 D5.A0
LED5
  Top 0.305: U30.104 43.33,25.29 44.2,26.16 44.2,27.18 44.7,27.69 D39.A
N$1
  Bottom 0.61: U11.1 14.54,41.18 L1.2
N$2
  Top 0.406: U14.17 34.16,47.12 35.31,48.26 37.05,48.26 C53.1
N$3
  Bottom 0.305: U04.7 14.99,46.74
  Bottom 0.406: 14.99,46.74 14.99,46.27 C1.1
  Bottom 1.016: C5.1 C1.1 | C1.1
N$4
  Bottom 0.305: R10.1 | R10.1
  Bottom 0.61: U11.4 16.42,36.41 arc90 17.27,35.56 17.53,35.56
  Bottom 0.711: 17.53,35.56 18.03,35.56
  Bottom 0.813: 18.03,35.56 18.54,35.56
  Bottom 0.914: 18.54,35.56 19.05,35.56
  Bottom 1.016: 19.05,35.56 R10.1
N$5
  Bottom 0.305: L6.1 10.59,44.41 R16.1
  Bottom 1.016: L6.1 9.91,47.5 | 9.91,47.5 C13.1 | C13.1 | C18.1 10.16,47.75 9.91,47.5
N$6
  Bottom 0.305: U07.3 24.9,47.25 24.89,47.24
  Bottom 0.406: 24.9,47.25 24.9,46.99 24.89,46.99
  Bottom 0.508: 24.89,46.99 24.89,46.52 C14.2
N$7
  Bottom 0.813: U05.B 6.86,54.89 6.86,54.86
  Bottom 0.965: 6.35,54.86 6.86,54.86
  Bottom 1.168: 5.84,54.86 6.35,54.86
  Bottom 1.372: 5.33,54.86 5.84,54.86
  Bottom 1.575: 4.83,54.86 5.33,54.86
  Bottom 1.778: J11.1 4.83,54.86
N$8
  Bottom 0.305: 13.97,47.5 14.48,47.5 U04.8
  Bottom 0.406: 13.97,47.5 13.72,47.5
  Bottom 0.508: 13.72,47.5 13.46,47.5
  Bottom 0.61: 13.46,47.5 13.21,47.5
  Bottom 0.711: 13.21,47.5 12.95,47.5
  Bottom 0.813: 12.95,47.5 12.7,47.5
  Bottom 0.914: 12.7,47.5 L6.2
  Bottom 1.016: L6.2 | L6.2 R14.1
N$9  (via drill 0.3)
  Top 0.305: D4.C1 47.54,10.63 v47.75,10.41
  Bottom 0.305: R12.1 47.54,10.63 v47.75,10.41
N$10
  Bottom 0.305: C19.1 12.74,39.55 R1.2
  Bottom 0.61: U11.6 12.98,37.06 12.95,37.08 12.95,37.12 12.74,37.34
  Bottom 1.016: C19.1 12.74,37.34 C4.1
N$11
  Bottom 0.305: 21.88,55.33 R3.2 22.35,55.16 22.35,52.62 C17.1 | U07.6 24.9,51.3 24.38,51.82 24.38,52.29
  Bottom 0.406: 24.38,52.29 L2.1
  Bottom 1.016: L2.1 C17.1 | C20.1 L2.1 | L2.1
N$12  (via drill 0.3)
  Top 0.305: v47.5,28.7 47.5,27.72 D39.C
  Bottom 0.305: v47.5,28.7 R34.1
N$13
  Top 0.813: R19.2 D6.A
N$14
  Bottom 0.406: U10.3 38.94,41.48 39.12,41.66 39.12,41.87 R8.1
  Bottom 1.016: C10.2 39.41,43.9 R8.1
N$15
  Bottom 0.305: C65.1 33.06,41.66 R5.2
  Bottom 0.406: U10.1 36.11,40.13 C11.1
  Bottom 1.016: C11.1 | C11.1 C65.1
N$16
  Bottom 0.305: C12.1 42.63,41.11 42.93,41.4 42.93,44.41 R6.2
  Bottom 0.406: U10.4 41.4,40.13 41.66,40.39
  Bottom 1.016: C66.1 41.66,40.39 C12.1
N$17
  Bottom 0.813: U08.P5 39.24,45.61 C10.1
N$18  (via drill 0.3)
  Top 0.305: D3.C 47.54,16.29 v47.5,16.26
  Bottom 0.305: D3.C 47.54,16.29 v47.5,16.26
N$19
  Bottom 0.813: U08.P6 37.97,45.61 C9.1
N$20
  Bottom 0.406: U10.2 38.28,41.48 38.1,41.66 38.1,41.87 R8.2
  Bottom 1.016: C9.2 37.81,43.9 R8.2
N$21
  Bottom 0.254: C7.1
  Bottom 0.305: U07.7 25.4,52.28 L2.2
  Bottom 0.406: 25.4,52.29 L2.2
  Bottom 1.016: C7.1 | L2.2 25.69,53.38 arc-90 27.69,55.37 C7.1 | C7.1 arc90 C7.1
N$22
  Bottom 0.254: R33.1
  Bottom 1.016: R32.1 R33.1 28.16,58.42 28.19,58.42 | R32.1
  Bottom 1.168: 28.19,58.93 28.19,58.42
  Bottom 1.372: 28.19,59.44 28.19,58.93
  Bottom 1.575: 28.19,59.94 28.19,59.44
  Bottom 1.778: J12.1 28.19,59.94
N$23
  Bottom 0.254: U09.4 35.81,52.83 36.07,52.58
  Bottom 0.813: U08.P1 36.7,51.94 36.07,52.58
N$24
  Bottom 0.813: U08.P2 37.97,52.2 38.35,52.58 U09.6
N$25
  Bottom 0.813: U06.E 24.61,44.64 R46.1 | R46.1
N$26
  Top 0.61: R21.1 20.32,48.17 U22.5 18.18,48.33 C60.1
N$28
  Bottom 0.305: 13.97,50.8 U04.1
  Bottom 0.406: 13.72,50.8 13.97,50.8
  Bottom 0.508: 13.46,50.8 13.72,50.8
  Bottom 0.61: 13.21,50.8 13.46,50.8
  Bottom 0.711: 12.95,50.8 13.21,50.8
  Bottom 0.813: 12.7,50.8 12.95,50.8
  Bottom 0.914: R14.2 12.7,50.84 12.7,50.8
N$29
  Bottom 0.229: R40.1
  Bottom 0.813: U05.E 14.87,54.89 R40.1
N$30
  Bottom 0.305: U04.2 14.99,51.82
  Bottom 0.406: 14.99,51.82 14.99,52.67 R41.1 L5.2
N$31
  Bottom 0.406: U10.7 38.28,37.41 37.59,38.1 35.6,38.1 R7.1
N$32
  Bottom 0.229: L1.1
  Bottom 1.016: C1.2 L1.1 R2.1
N$38
  Top 0.305: R36.1 D1.C1
N$39  (via drill 0.3)
  Top 0.305: D4.C0 47.54,14.44 v47.5,14.48
  Bottom 0.305: R22.1 47.54,14.44 v47.5,14.48
N$40  (via drill 0.3)
  Top 0.305: D5.C1 47.54,20.61 v47.5,20.57
  Bottom 0.305: R35.1 47.54,20.61 v47.5,20.57
N$41  (via drill 0.3)
  Top 0.305: D1.C0 47.29,5.63 v47.24,5.59
  Bottom 0.305: R37.1 v47.24,5.59
N$42  (1 unrouted)
  Top 0.61: U24.5 7.98,43.32 R18.1
N$43
  Top 0.305: U1.4 29.52,51 28.96,51.56 28.96,52.79
  Top 0.406: 28.96,52.79 C54.1
N$44  (via drill 0.3)
  Top 0.305: D5.C0 47.54,24.6 v47.5,24.64
  Bottom 0.305: R38.1 47.54,24.6 v47.5,24.64
N$49
  Bottom 0.305: C2.2 | C2.2
  Bottom 0.813: U06.B 24.61,37.56 arc-90 22.61,35.56 22.35,35.56
  Bottom 0.914: 21.59,35.56 22.35,35.56
  Bottom 1.016: 21.59,35.56 C2.2
N$51
  Bottom 0.254: C7.2
  Bottom 0.813: 31.75,55.37 arc37 34.04,56.13 arc-52 U09.3
  Bottom 0.914: 30.73,55.37 31.75,55.37
  Bottom 1.016: C7.2 30.73,55.37
SST1  (via drill 0.3)
  Top 0.305: U30.74 40.13,10.29 v39.88,10.54
  Bottom 0.305: U23.1 39.25,7.5 39.88,8.13 v39.88,10.54
SST2  (via drill 0.3)
  Top 0.305: U30.69 37.73,8.77 38.1,9.14 v38.86,9.14
  Bottom 0.305: U23.2 37.98,8.26 v38.86,9.14
SST5  (via drill 0.3)
  Top 0.305: U30.67 36.73,9.55 v37.08,9.91
  Bottom 0.305: U23.5 35.44,12.31 36.32,11.43 36.58,11.43 37.08,10.92 v37.08,9.91
SST6  (via drill 0.3)
  Top 0.305: U30.68 37.23,9.04 v38.1,9.91
  Bottom 0.305: U23.6 36.71,12.31 38.1,10.92 v38.1,9.91
SST7  (via drill 0.3)
  Top 0.305: U30.76 38.75,11.29 v38.61,11.43
  Bottom 0.61: U23.7 37.98,12.06 v38.61,11.43
USB5V
  Top 0.508: 40.39,53.89 R31.1 | J02.1 41.54,52.25 C6.1
  Top 1.016: C55.1 R31.1 40.17,53.3 41.15,52.32 C6.1 | C55.1
USBDM  (via drill 0.3)
  Top 0.406: U14.16 34.81,46.5 v35.05,46.74
  Top 0.508: J02.2 45.34,53.05 v45.47,52.92
  Route8 0.406: v35.05,46.74 43.69,46.74 45.47,48.51 v45.47,52.92
USBDP  (via drill 0.3)
  Top 0.406: U14.15 35.46,45.62 v35.81,45.97
  Top 0.508: J02.3 45.34,53.85 v45.47,53.98
  Route8 0.406: v45.47,53.98 45.59,53.98 46.23,53.34 46.23,48.26 43.94,45.97 v35.81,45.97
VDD  (via drill 0.3, 0.5)
  Top 0.305: U30.5 18.4,25.29 v18.03,25.59 | U30.116 35.73,28.02 36.07,27.69 v36.32,27.69 | U30.109 39.71,29.29 v39.88,29.46 | U30.102 42.58,24.29 v42.67,24.38 | U30.134 26.73,30.92 v27.05,31.24 | U30.29 18.71,13.29 v18.29,13.72 | U30.78 42.32,12.29 v42.67,11.94 | U30.61 33.73,6.55 v33.53,6.35 | U30.45 25.73,6.66 v26.04,6.35 | v20.95,8.13 21.73,8.13 U30.37
  Top 0.813: C46.1 27.18,31.37 v27.05,31.24 | v18.29,13.72 17.31,13.72 C43.1
  Top 1.016: v19.05,43.94 v17.78,42.67 v19.05,42.67 | v19.05,43.94 18.8,43.43 19.01,43.65 R21.2 | v19.05,42.67 v19.05,43.94 | v19.05,42.67 C64.1
  Bottom 0.813: v39.88,29.46 C45.1 | C39.1 36.58,27.94 v36.32,27.69 | v18.03,25.59 18.03,25.95 C37.1 | C44.1 v42.67,11.94 | C41.1 v33.53,6.35 | C40.1 26.16,6.48 v26.04,6.35 | C42.1 v20.95,8.13 | C38.1 v42.67,24.38
  Bottom 1.016: v17.78,42.67 v19.05,42.67 v19.05,43.94 v17.78,42.67
  pour Route8: 39.37,8.38 20.83,8.38 20.57,8.13 20.57,6.6 22.61,6.6 23.11,7.11 24.13,7.11 25.15,6.1 26.16,6.1 26.29,6.35 26.29,6.6 26.8,7.11 32.77,7.11 32.77,6.35 33.27,5.84 33.53,5.84 33.78,6.1 33.78,6.6 34.29,7.11 40.39,7.11 43.18,9.91 43.18,27.43 41.15,29.97 28.45,29.97 27.69,30.73 27.69,31.24 25.15,33.78 17.78,33.78 17.78,32.51 24.38,32.51 26.16,30.73 26.16,29.97 27.43,28.7 34.8,28.7 36.32,27.18 36.83,27.18 37.59,27.94 39.37,27.94 40.89,26.42 40.89,9.91
  pour Route8: 17.53,25.15 17.53,13.97 18.03,13.46 18.54,13.46 20.07,14.99 20.07,25.15 18.8,26.42 17.78,27.69 17.78,34.29 13.97,30.48 13.97,28.19
  pour Route8: 19.81,44.7 18.8,44.7 17.02,42.93 17.02,41.91 17.78,41.4 17.78,33.53 21.34,33.53 21.34,43.18
VPP  (via drill 0.3, 0.5)
  Top 0.305: U30.107 38.99,26.79 v38.86,26.92 | U30.35 20.96,10.29 v21.08,10.41 | U30.96 40.09,21.29 v39.88,21.08
  Top 0.813: JTAG.4 12.95,5.37 C47.1
  Top 1.016: R18.2 v7.87,40.39 | v7.87,40.39 v7.87,39.12 8.38,39.12 | 8.38,39.12 v9.14,39.12 v7.87,40.39 | C51.1 8.38,39.12
  Bottom 0.813: v38.86,26.92 39.08,26.71 C49.1 39.92,26.67 C48.1 | R26.2 v7.87,12.45 R25.2 | C50.1 C52.1 21.81,10.41 v21.08,10.41
  Bottom 1.016: v7.87,40.39 v7.87,39.12 v9.14,39.12 v7.87,40.39
  pour Route8: 21.08,11.68 22.1,9.91 17.78,9.91 14.48,6.6 11.43,6.6 0,18.03 0,37.59 3.56,41.15 8.38,41.15 9.91,39.62 9.91,38.86 9.4,38.35 4.32,38.35 4.32,18.03 10.16,11.68
  pour Route8: 38.61,27.43 39.12,27.43 40.39,26.16 40.39,21.08 36.83,17.53 36.32,17.53 32.77,13.97 28.96,13.97 26.42,11.43 23.62,11.43 22.1,9.91 20.57,11.68 22.1,11.68 24.38,13.97 26.92,13.97 28.45,15.49 30.73,15.49 37.85,22.35 37.85,26.67
XO
  Top 0.305: U30.22 15.28,16.79 U20.3

## Text on the board
tPlace: 1.09GHz Receiver | Designed by Dabin Zhang | dbnzhang@gmail.com | v2.0 | All Rights Reserved